# EAGLE design ctrlr_board (EAGLE 6.1)
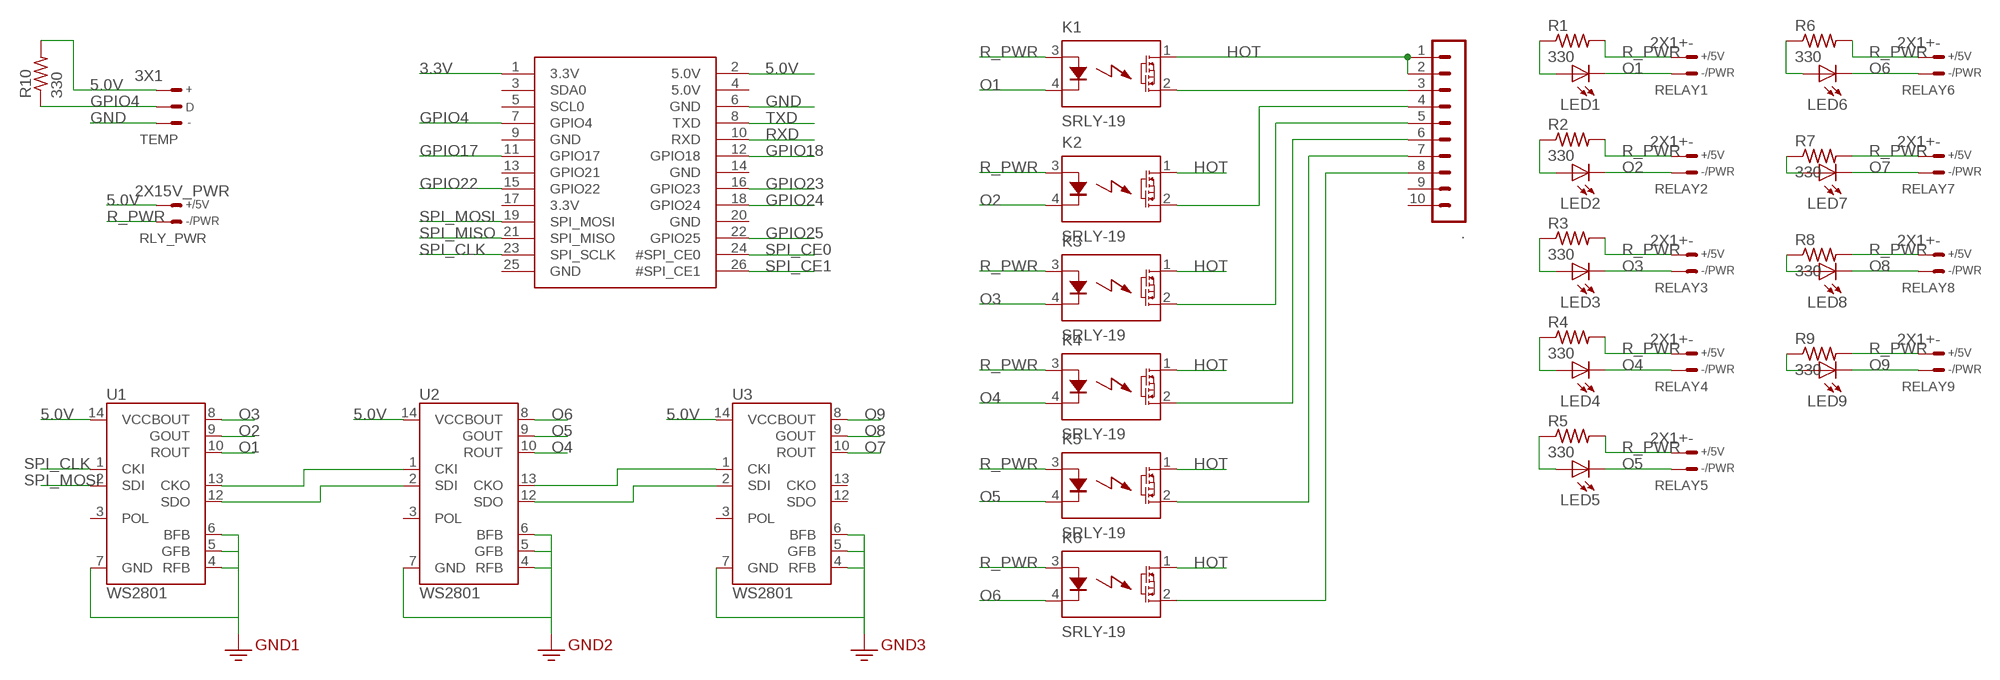
[diagram p0: schematic, sheet 1]

## Parts
.  10X1  [HDR10]
K1  SRLY-19  [OAC5]
K2  SRLY-19  [OAC5]
K3  SRLY-19  [OAC5]
K4  SRLY-19  [OAC5]
K5  SRLY-19  [OAC5]
K6  SRLY-19  [OAC5]
LED1  LED  [LED0603]
LED2  LED  [LED0603]
LED3  LED  [LED0603]
LED4  LED  [LED0603]
LED5  LED  [LED0603]
LED6  LED  [LED0603]
LED7  LED  [LED0603]
LED8  LED  [LED0603]
LED9  LED  [LED0603]
R1  330  RESISTOR  [R0603]
R2  330  RESISTOR  [R0603]
R3  330  RESISTOR  [R0603]
R4  330  RESISTOR  [R0603]
R5  330  RESISTOR  [R0603]
R6  330  RESISTOR  [R0603]
R7  330  RESISTOR  [R0603]
R8  330  RESISTOR  [R0603]
R9  330  RESISTOR  [R0603]
R10  330  RESISTOR  [R0603]
RELAY1  2X1+-  [HDR2]
RELAY2  2X1+-  [HDR2]
RELAY3  2X1+-  [HDR2]
RELAY4  2X1+-  [HDR2]
RELAY5  2X1+-  [HDR2]
RELAY6  2X1+-  [HDR2]
RELAY7  2X1+-  [HDR2]
RELAY8  2X1+-  [HDR2]
RELAY9  2X1+-  [HDR2]
RLY_PWR  2X15V_PWR  [HDR2_5V_PWR]
RPI_HDR  RASPBERRY_PI_HEADERRASPI_HDR  [RASPBERRY_PI_HEADER]
TEMP  3X1  [HDR3]
U1  WS2801  [SOP-14]
U2  WS2801  [SOP-14]
U3  WS2801  [SOP-14]

## Nets
3.3V: RPI_HDR.1(3.3V)
5.0V: R10.2 RLY_PWR.+ RPI_HDR.2(5.0V) TEMP.+ U1.14(VCC) U2.14(VCC) U3.14(VCC)
GND: RPI_HDR.6(GND) TEMP.- U1.4(RFB) U1.5(GFB) U1.6(BFB) U1.7(GND) U2.4(RFB) U2.5(GFB) U2.6(BFB) U2.7(GND) U3.4(RFB) U3.5(GFB) U3.6(BFB) U3.7(GND) ; supply symbol labelled GND2
GPIO4: R10.1 RPI_HDR.7(GPIO4) TEMP.D
GPIO17: RPI_HDR.11(GPIO17)
GPIO18: RPI_HDR.12(GPIO18)
GPIO22: RPI_HDR.15(GPIO22)
GPIO23: RPI_HDR.16(GPIO23)
GPIO24: RPI_HDR.18(GPIO24)
GPIO25: RPI_HDR.22(GPIO25)
HOT: ..1 ..2 K1.1(D1) K2.1(D1) K3.1(D1) K4.1(D1) K5.1(D1) K6.1(D1)
N$1: LED1.A R1.1
N$2: LED2.A R2.1
N$3: LED3.A R3.1
N$4: LED4.A R4.1
N$5: LED6.A R6.1
N$6: LED5.A R5.1
N$7: ..4 K2.2(D2)
N$8: ..5 K3.2(D2)
N$9: ..6 K4.2(D2)
N$10: ..7 K5.2(D2)
N$11: ..8 K6.2(D2)
N$12: ..3 K1.2(D2)
N$13: LED7.A R7.1
N$14: LED8.A R8.1
N$15: U1.13(CKO) U2.1(CKI)
N$16: U1.12(SDO) U2.2(SDI)
N$17: U2.12(SDO) U3.2(SDI)
N$18: U2.13(CKO) U3.1(CKI)
N$19: LED9.A R9.1
O1: K1.4(K) LED1.C RELAY1.- U1.10(ROUT)
O2: K2.4(K) LED2.C RELAY2.- U1.9(GOUT)
O3: K3.4(K) LED3.C RELAY3.- U1.8(BOUT)
O4: K4.4(K) LED4.C RELAY4.- U2.10(ROUT)
O5: K5.4(K) LED5.C RELAY5.- U2.9(GOUT)
O6: K6.4(K) LED6.C RELAY6.- U2.8(BOUT)
O7: LED7.C RELAY7.- U3.10(ROUT)
O8: LED8.C RELAY8.- U3.9(GOUT)
O9: LED9.C RELAY9.- U3.8(BOUT)
R_PWR: K1.3(A) K2.3(A) K3.3(A) K4.3(A) K5.3(A) K6.3(A) R1.2 R2.2 R3.2 R4.2 R5.2 R6.2 R7.2 R8.2 R9.2 RELAY1.+ RELAY2.+ RELAY3.+ RELAY4.+ RELAY5.+ RELAY6.+ RELAY7.+ RELAY8.+ RELAY9.+ RLY_PWR.-
RXD: RPI_HDR.10(RXD)
SPI_CE0: RPI_HDR.24(#SPI_CE0)
SPI_CE1: RPI_HDR.26(#SPI_CE1)
SPI_CLK: RPI_HDR.23(SPI_SCLK) U1.1(CKI)
SPI_MISO: RPI_HDR.21(SPI_MISO)
SPI_MOSI: RPI_HDR.19(SPI_MOSI) U1.2(SDI)
TXD: RPI_HDR.8(TXD)
Unconnected: ..9 ..10 RPI_HDR.3(SDA0) RPI_HDR.4(5.0V) RPI_HDR.5(SCL0) RPI_HDR.9(GND) RPI_HDR.13(GPIO21) RPI_HDR.14(GND) RPI_HDR.17(3.3V) RPI_HDR.20(GND) RPI_HDR.25(GND) U1.3(POL) U2.3(POL) U3.3(POL) U3.12(SDO) U3.13(CKO)

## Library data of the parts
. = dz:10X1
K1-K6 = dz:SRLY-19
LED1-LED9 = dz:LED
R1-R10 = dz:RESISTOR
RELAY1-RELAY9 RLY_PWR = dz:2X1
RPI_HDR = dz:RASPBERRY_PI_HEADER
TEMP = dz:3X1
U1-U3 = SparkFun-DigitalIC:WS2801: WS2801 3 Channel Constant Current LED Driver with programmable PWM outputs. Datasheet: http://www.sparkfun.com/datasheets/Components/LED/WS2801.pdf

## Board
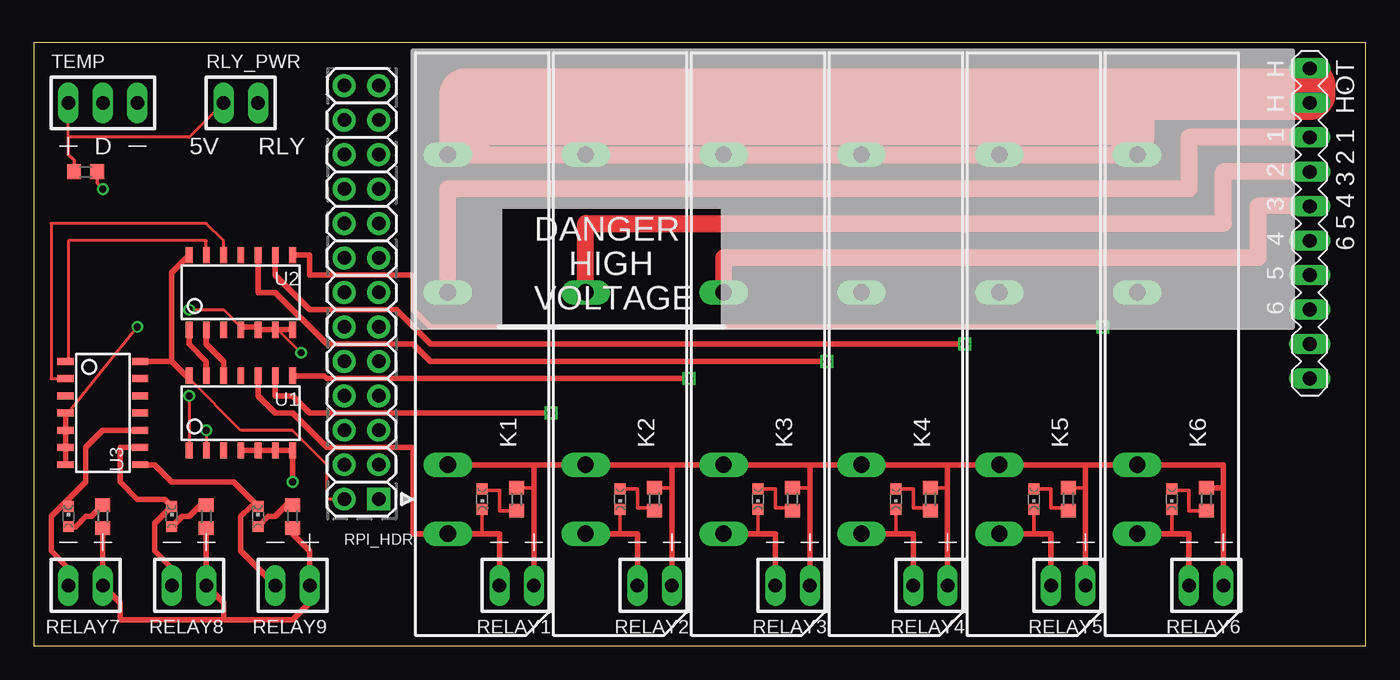
[diagram p1: board, top side]
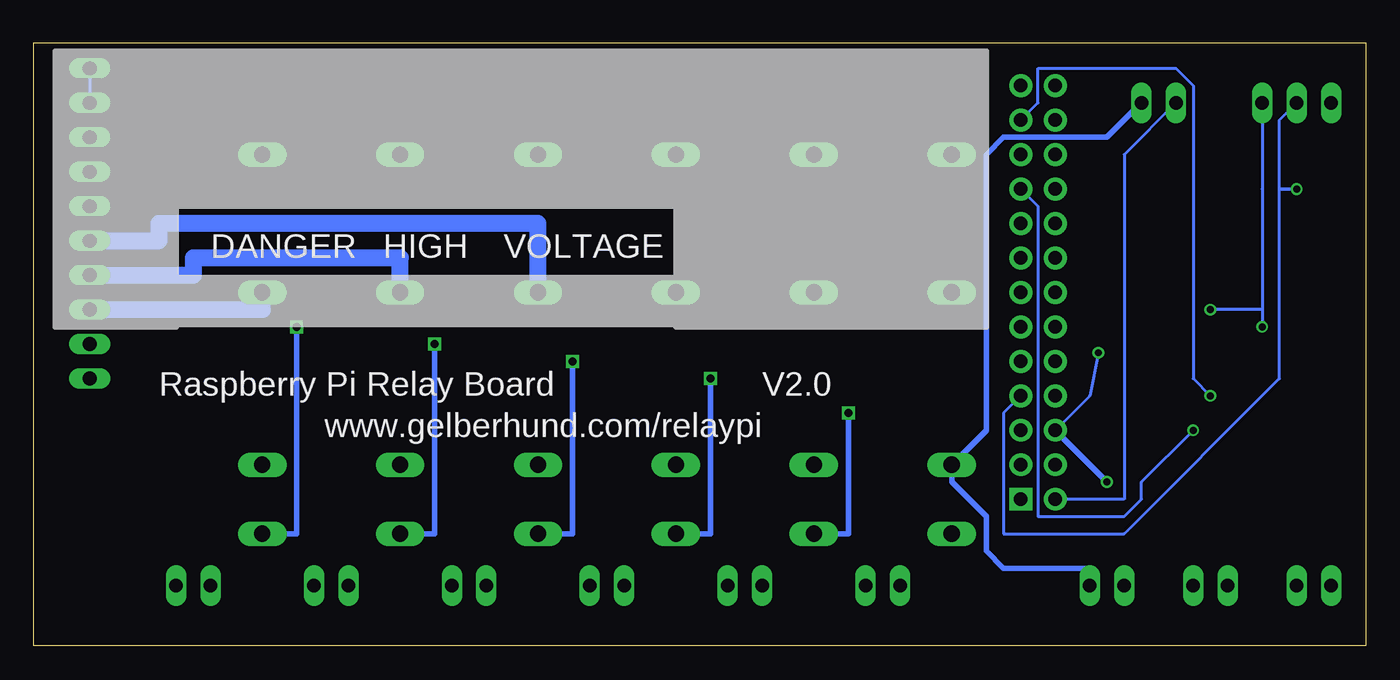
[diagram p2: board, bottom side, seen from below]

Size 98.09 x 44.44 mm. Coordinates in mm from the lower left corner, seen from the top.
Outline: 0,0 98.09,0 98.09,44.44 0,44.44 0,0
Copper layers (1*16): Top 0.0356mm / dielectric 1.5011mm / Bottom 0.0356mm
Design rules: minimum track width 6mil, minimum drill 13mil, track to track 6mil, track to pad 6mil, pad to pad 6mil, via to via 6mil, smd to smd 6mil, copper to edge 15mil, drill to drill 6mil, minimum pad ring 7mil, minimum via ring 7mil, stop-mask expansion 4mil, vias tented up to drill 0mil, thermal gap 10mil

### Footprints (pad centres in the part's own frame; a part is rotated, then mirrored left to right if it is on the bottom)
HDR10 = drill 1.016 long: 1 -11.43,0; 2 -8.89,0; 3 -6.35,0; 4 -3.81,0; 5 -1.27,0; 6 1.27,0; 7 3.81,0; 8 6.35,0; 9 8.89,0; 10 11.43,0
OAC5 = drill 1.2 long: 1 13.97,2.54; 2 3.81,2.54; 3 -8.89,2.54; 4 -13.97,2.54
LED0603 = smd 0.8 x 0.8: A 0,-0.75; C 0,0.75
R0603 = smd 1 x 1.1: 1 -0.85,0; 2 0.85,0
HDR2 = drill 1 long: + -1.27,0; - 1.27,0
HDR2_5V_PWR = drill 1 long: + -1.27,0; - 1.27,0
RASPBERRY_PI_HEADER = drill 1 pad 1.676 square: 1 -1.27,15.24 | drill 1 pad 1.676: 2 1.27,15.24; 3 -1.27,12.7; 4 1.27,12.7; 5 -1.27,10.16; 6 1.27,10.16; 7 -1.27,7.62; 8 1.27,7.62; 9 -1.27,5.08; 10 1.27,5.08; 11 -1.27,2.54; 12 1.27,2.54; 13 -1.27,0; 14 1.27,0; 15 -1.27,-2.54; 16 1.27,-2.54; 17 -1.27,-5.08; 18 1.27,-5.08; 19 -1.27,-7.62; 20 1.27,-7.62; 21 -1.27,-10.16; 22 1.27,-10.16; 23 -1.27,-12.7; 24 1.27,-12.7; 25 -1.27,-15.24; 26 1.27,-15.24
HDR3 = drill 1 long: + -2.54,0; - 2.54,0; D 0,0
SOP-14 = smd 0.5 x 1.2: 1 -3.81,-2.75; 2 -2.54,-2.75; 3 -1.27,-2.75; 4 0,-2.75; 5 1.27,-2.75; 6 2.54,-2.75; 7 3.81,-2.75; 8 3.81,2.75; 9 2.54,2.75; 10 1.27,2.75; 11 0,2.75; 12 -1.27,2.75; 13 -2.54,2.75; 14 -3.81,2.75

### Placement (x,y rotation side)
.  93.98,31.12 270 top
K1  33.02,22.23 90 top
K2  43.18,22.23 90 top
K3  53.34,22.23 90 top
K4  63.5,22.23 90 top
K5  73.66,22.23 90 top
K6  83.82,22.23 90 top
LED1  33.02,10.79 180 top
LED2  43.18,10.79 180 top
LED3  53.34,10.79 180 top
LED4  63.5,10.79 180 top
LED5  73.66,10.79 180 top
LED6  83.82,10.79 180 top
LED7  2.54,9.53 0 top
LED8  10.16,9.53 0 top
LED9  16.51,9.53 0 top
R1  35.56,10.79 90 top
R2  45.72,10.79 90 top
R3  55.88,10.79 90 top
R4  66.04,10.79 90 top
R5  76.2,10.79 90 top
R6  86.36,10.79 90 top
R7  5.08,9.53 270 top
R8  12.7,9.53 270 top
R9  19.05,9.53 270 top
R10  3.81,34.92 180 top
RELAY1  35.56,4.45 180 top
RELAY2  45.72,4.45 180 top
RELAY3  55.88,4.45 180 top
RELAY4  66.04,4.45 180 top
RELAY5  76.2,4.45 180 top
RELAY6  86.36,4.45 180 top
RELAY7  3.81,4.45 180 top
RELAY8  11.43,4.45 180 top
RELAY9  19.05,4.45 180 top
RLY_PWR  15.24,40 0 top
RPI_HDR  24.13,26.04 180 top
TEMP  5.08,40 0 top
U1  15.24,17.15 0 top
U2  15.24,26.04 0 top
U3  5.08,17.15 270 top

### Tracks (layer width: path | path; a pad name or v marks a point on that pad's centre or on a via)
5.0V
  Top 0.203: TEMP.+ 2.54,37.46 11.43,37.46 RLY_PWR.+ | RPI_HDR.2 21.59,10.79 21.59,13.33 19.05,15.88 15.24,15.88 11.43,19.69 U1.14
  Top 0.254: R10.2 2.96,35.77 2.54,36.2 2.54,37.46
  Top 0.406: U1.14 11.22,19.9 10.16,20.96 | U3.14 10.16,20.96 | 10.16,20.96 10.16,27.52 U2.14
  Bottom 0.203: RPI_HDR.2 17.78,10.79 17.78,36.2 RLY_PWR.+
GND  (via drill 0.51)
  Top 0.203: v7.62,23.5 2.54,17.15 U3.4 | 15.24,23.5 13.97,24.77 v11.43,24.77 | v19.69,21.59 17.78,23.5 U2.6
  Top 0.406: U3.4 U3.5 U3.6 U3.7 | U2.7 U2.6 U2.5 16.3,23.5 15.24,23.5 U2.4 | U1.4 U1.5 U1.6 U1.7 v19.05,12.06
  Bottom 0.203: TEMP.- 7.62,33.66 7.62,24.77 | 7.62,24.77 v7.62,23.5 | 7.62,24.77 v11.43,24.77 | RPI_HDR.6 20.32,18.42 v19.69,21.59
  Bottom 0.406: RPI_HDR.6 v19.05,12.06
GPIO4  (via drill 0.51)
  Top 0.254: R10.1 4.66,34.07 v5.08,33.66
  Bottom 0.203: TEMP.D 6.35,38.73 6.35,33.66 6.35,19.69 17.78,8.26 26.67,8.26 26.67,17.15 RPI_HDR.7
  Bottom 0.254: v5.08,33.66 6.35,33.66
HOT
  Top 0.203: ..2 93.98,40.64
  Top 0.406: 81.28,40 81.28,38.73
  Top 1.27: 80.01,36.2 K5.1 K4.1 K3.1 K2.1 K1.1 30.48,38.73 81.28,38.73 81.28,37.46 | 80.01,36.2 K6.1 81.28,37.46 | 93.98,41.27 81.28,41.27 | 81.28,41.27 80.01,41.27 80.01,37.46 | 80.01,37.46 31.75,37.46 30.48,37.46 | 81.28,41.27 81.28,40 | 81.28,37.46 80.01,37.46 | 80.01,37.46 80.01,36.2
  Top 2.54: 81.28,40 81.28,37.46
  Top 3.81: 31.75,37.46 31.75,40.64 93.98,40.64 93.98,41.27
  Bottom 0.203: ..1 ..2
N$1
  Top 0.254: R1.1 34.29,9.95 34.29,11.43 33.02,11.43 LED1.A
N$2
  Top 0.254: LED2.A 44.45,11.54 44.45,10.16 45.72,10.16 R2.1
N$3
  Top 0.254: LED3.A 54.61,11.54 54.61,10.16 55.88,10.16 R3.1
N$4
  Top 0.254: LED4.A 64.77,11.54 64.77,10.16 66.04,10.16 R4.1
N$5
  Top 0.254: R6.1 85.09,9.95 85.09,11.43 83.82,11.43 LED6.A
N$6
  Top 0.254: LED5.A 74.93,11.54 74.93,10.16 76.2,10.16 R5.1
N$7
  Top 1.27: K2.2 40.64,31.12 87.63,31.12 87.63,34.92 ..4
N$8
  Top 1.27: K3.2 50.8,28.58 90.17,28.58 90.17,32.38 ..5
N$9
  Bottom 1.27: K4.2 60.96,31.12 88.9,31.12 88.9,29.85 ..6
N$10
  Bottom 1.27: K5.2 71.12,28.58 86.36,28.58 86.36,27.31 ..7
N$11
  Bottom 1.27: K6.2 81.28,24.77 ..8
N$12
  Top 1.27: K1.2 30.48,33.66 85.09,33.66 85.09,37.46 ..3
N$13
  Top 0.406: LED7.A 3.06,8.78 3.81,9.53 4.23,9.53 R7.1
N$14
  Top 0.406: R8.1 12.28,10.38 11.43,9.53 10.91,9.53 LED8.A
N$15
  Top 0.406: U2.1 11.43,22.23 12.7,20.96 U1.13 12.7,19.69
N$16
  Top 0.406: U1.12 13.97,20.96 12.7,22.23 U2.2
N$17
  Top 0.203: U3.2 1.27,19.69 1.27,31.12 12.7,31.12 13.97,29.85 U2.12 13.97,28.58
  Top 0.406: U3.2 2.54,19.69
N$18
  Top 0.203: U3.1 2.54,20.96 2.54,29.85 12.7,29.85 U2.13 12.7,28.58
N$19
  Top 0.406: R9.1 18.63,10.38 17.78,9.53 17.26,9.53 LED9.A
O1
  Top 0.254: LED1.C 33.02,8.26
  Top 0.406: RELAY1.- 34.29,8.26 33.02,8.26 K1.4 27.94,8.26 27.94,14.61 21.59,14.61 19.05,17.15 17.78,17.15 16.51,18.42 U1.10
O2  (via drill 0.6)
  Top 0.254: LED2.C 43.18,8.26
  Top 0.406: RELAY2.- 44.45,8.26 43.18,8.26 K2.4 | U1.9 17.78,18.42 19.05,18.42 20.32,17.15 v38.1,17.15
  Bottom 0.406: v38.1,17.15 38.1,8.26 K2.4
O3  (via drill 0.6)
  Top 0.254: LED3.C 53.34,8.26
  Top 0.406: RELAY3.- 54.61,8.26 53.34,8.26 K3.4 | 48.05,19.9 v48.26,19.69 21.59,19.69 21.38,19.9 U1.8
  Bottom 0.406: v48.26,19.69 48.26,8.26 K3.4
O4  (via drill 0.6)
  Top 0.254: LED4.C 63.5,8.26
  Top 0.406: RELAY4.- 64.77,8.26 63.5,8.26 K4.4 | U2.10 16.51,26.04 17.78,26.04 21.59,22.23 27.94,22.23 29.21,20.96 v58.42,20.96
  Bottom 0.406: v58.42,20.96 58.42,8.26 K4.4
O5  (via drill 0.6)
  Top 0.254: LED5.C 73.66,8.26
  Top 0.406: RELAY5.- 74.93,8.26 73.66,8.26 K5.4 | U2.9 17.78,27.31 20.32,24.77 26.67,24.77 29.21,22.23 v68.58,22.23
  Bottom 0.406: v68.58,22.23 68.58,8.26 K5.4
O6  (via drill 0.6)
  Top 0.254: LED6.C 83.82,8.26
  Top 0.406: RELAY6.- 85.09,8.26 83.82,8.26 K6.4 | U2.8 20.32,28.79 20.32,27.31 27.94,27.31 27.94,24.77 29.21,23.5 v78.74,23.5
  Bottom 0.406: K6.4 78.74,8.26 v78.74,23.5
O7
  Top 0.406: LED7.C 2.54,10.79 | 2.54,10.79 3.81,12.06 3.81,14.61 5.08,15.88 U3.10 | RELAY7.- 2.54,5.71 1.27,6.98 1.27,9.53 2.54,10.79
O8
  Top 0.406: U3.9 6.35,14.61 6.35,12.06 7.62,10.79 9.64,10.79 LED8.C 8.89,9 8.89,6.98 10.16,5.71 RELAY8.-
O9
  Top 0.406: U3.8 8.89,13.33 10.16,12.06 14.72,12.06 LED9.C 15.99,10.28 15.24,9.53 15.24,6.98 RELAY9.-
R_PWR
  Top 0.254: R1.2 36.83,11.64 36.83,12.06 | R2.2 46.99,11.64 46.99,12.06 | R3.2 57.15,11.64 57.15,12.06 | R4.2 67.31,11.64 67.31,12.06 | R5.2 77.47,11.64 77.47,12.06
  Top 0.406: RELAY1.+ 36.83,12.06 36.83,13.33 | RELAY2.+ 46.99,12.06 46.99,13.33 | RELAY3.+ 57.15,12.06 57.15,13.33 | RELAY4.+ 67.31,12.06 67.31,13.33 | RELAY5.+ 77.47,12.06 77.47,13.33 | 77.47,13.33 K5.3 67.31,13.33 | K1.3 36.83,13.33 | 46.99,13.33 K2.3 36.83,13.33 | 57.15,13.33 K3.3 46.99,13.33 | 67.31,13.33 K4.3 57.15,13.33 | 77.47,13.33 K6.3 87.63,13.33 87.63,11.64 | RELAY6.+ 87.63,11.64 | R6.2 87.63,11.64 | R7.2 RELAY7.+ 6.35,3.17 6.35,1.91 13.97,1.91 | R9.2 19.05,8.26 20.32,6.98 RELAY9.+ 20.32,3.17 19.05,1.91 13.97,1.91 | R8.2 RELAY8.+ 13.97,3.17 13.97,1.91
  Bottom 0.406: RELAY9.+ 20.32,5.71 26.67,5.71 27.94,6.98 27.94,9.53 30.48,12.06 K1.3 27.94,15.88 27.94,36.2 26.67,37.46 19.05,37.46 RLY_PWR.-
SPI_CLK  (via drill 0.51)
  Top 0.203: v11.43,18.42 U1.1
  Bottom 0.203: v11.43,18.42 12.7,19.69 12.7,41.27 13.97,42.54 24.13,42.54 24.13,40 RPI_HDR.23
SPI_MOSI  (via drill 0.51)
  Top 0.203: v12.7,15.88 U1.2
  Bottom 0.203: v12.7,15.88 16.51,12.06 16.51,10.79 17.78,9.53 24.13,9.53 24.13,32.38 RPI_HDR.19

### Text on the board
tPlace: HOT | 6 5 4 3 2 1 | DANGER | HIGH | VOLTAGE
bPlace: VOLTAGE | HIGH | DANGER | V2.0 | Raspberry Pi Relay Board | www.gelberhund.com/relaypi